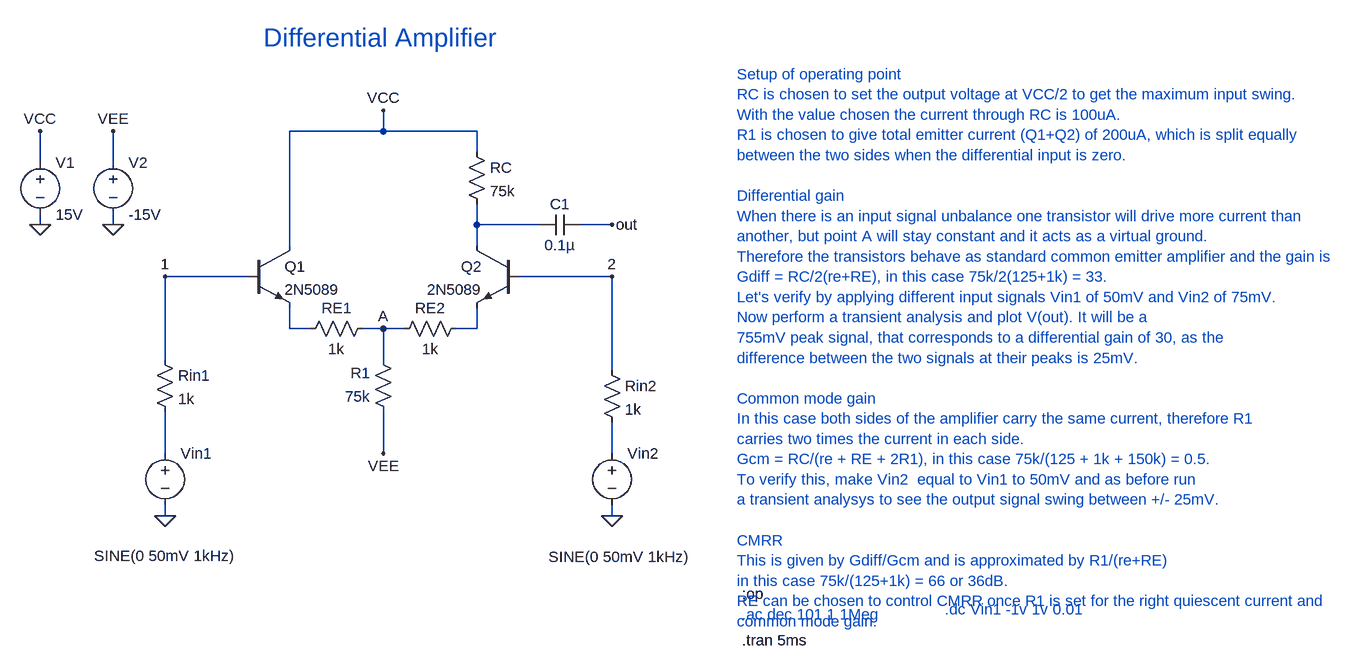
[diagram p0: schematic Figure2.68.asc]
Figure2.68.asc, the LTspice schematic file:
Version 4
SHEET 1 2392 1424
WIRE 272 -64 272 -96
WIRE 272 -64 128 -64
WIRE 416 -64 272 -64
WIRE 416 -32 416 -64
WIRE -256 -16 -256 -64
WIRE -144 -16 -144 -64
WIRE -256 80 -256 64
WIRE -144 80 -144 64
WIRE 416 80 416 48
WIRE 512 80 416 80
WIRE 624 80 576 80
WIRE 128 112 128 -64
WIRE 416 112 416 80
WIRE 64 160 -64 160
WIRE 624 160 480 160
WIRE 128 240 128 208
WIRE 160 240 128 240
WIRE 272 240 240 240
WIRE 304 240 272 240
WIRE 416 240 416 208
WIRE 416 240 384 240
WIRE -64 288 -64 160
WIRE 272 288 272 240
WIRE 624 304 624 160
WIRE -64 432 -64 368
WIRE 272 432 272 368
WIRE 624 432 624 384
WIRE -64 528 -64 512
WIRE 624 528 624 512
FLAG -256 80 0
FLAG -144 80 0
FLAG -256 -64 VCC
FLAG -144 -64 VEE
FLAG 272 432 VEE
FLAG 272 -96 VCC
FLAG -64 528 0
FLAG 624 80 out
FLAG 272 240 A
FLAG 624 160 2
FLAG 624 528 0
FLAG -64 160 1
SYMBOL npn 64 112 R0
SYMATTR InstName Q1
SYMATTR Value 2N5089
SYMBOL npn 480 112 M0
SYMATTR InstName Q2
SYMATTR Value 2N5089
SYMBOL res 256 224 R90
WINDOW 0 0 56 VBottom 2
WINDOW 3 32 56 VTop 2
SYMATTR InstName RE1
SYMATTR Value 1k
SYMBOL res 400 224 R90
WINDOW 0 0 56 VBottom 2
WINDOW 3 32 56 VTop 2
SYMATTR InstName RE2
SYMATTR Value 1k
SYMBOL res 288 384 R180
WINDOW 0 36 76 Left 2
WINDOW 3 36 40 Left 2
SYMATTR InstName R1
SYMATTR Value 75k
SYMBOL voltage -256 -32 R0
WINDOW 123 0 0 Left 0
WINDOW 39 0 0 Left 0
SYMATTR InstName V1
SYMATTR Value 15V
SYMBOL voltage -144 -32 R0
WINDOW 123 0 0 Left 0
WINDOW 39 0 0 Left 0
SYMATTR InstName V2
SYMATTR Value -15V
SYMBOL voltage -64 416 R0
WINDOW 3 -109 174 Left 2
WINDOW 123 -48 148 Left 2
WINDOW 39 0 0 Left 0
SYMATTR Value SINE(0 50mV 1kHz)
SYMATTR InstName Vin1
SYMBOL res 400 -48 R0
SYMATTR InstName RC
SYMATTR Value 75k
SYMBOL cap 576 64 R90
WINDOW 0 0 32 VBottom 2
WINDOW 3 32 32 VTop 2
SYMATTR InstName C1
SYMATTR Value 0.1µ
SYMBOL voltage 624 416 R0
WINDOW 3 -98 175 Left 2
WINDOW 123 -98 203 Left 2
WINDOW 39 0 0 Left 0
SYMATTR Value SINE(0 50mV 1kHz)
SYMATTR InstName Vin2
SYMBOL res -80 272 R0
SYMATTR InstName Rin1
SYMATTR Value 1k
SYMBOL res 608 288 R0
SYMATTR InstName Rin2
SYMATTR Value 1k
TEXT 824 648 Left 2 !;op
TEXT 816 -152 Left 2 ;Setup of operating point\nRC is chosen to set the output voltage at VCC/2 to get the maximum input swing.\nWith the value chosen the current through RC is 100uA.\nR1 is chosen to give total emitter current (Q1+Q2) of 200uA, which is split equally\nbetween the two sides when the differential input is zero.\n \nDifferential gain\nWhen there is an input signal unbalance one transistor will drive more current than \nanother, but point A will stay constant and it acts as a virtual ground.\nTherefore the transistors behave as standard common emitter amplifier and the gain is\nGdiff = RC/2(re+RE), in this case 75k/2(125+1k) = 33.\nLet's verify by applying different input signals Vin1 of 50mV and Vin2 of 75mV.\nNow perform a transient analysis and plot V(out). It will be a \n755mV peak signal, that corresponds to a differential gain of 30, as the \ndifference between the two signals at their peaks is 25mV.\n \nCommon mode gain\nIn this case both sides of the amplifier carry the same current, therefore R1\ncarries two times the current in each side.\nGcm = RC/(re + RE + 2R1), in this case 75k/(125 + 1k + 150k) = 0.5.\nTo verify this, make Vin2  equal to Vin1 to 50mV and as before run \na transient analysys to see the output signal swing between +/- 25mV.\n \nCMRR\nThis is given by Gdiff/Gcm and is approximated by R1/(re+RE) \nin this case 75k/(125+1k) = 66 or 36dB.\nRE can be chosen to control CMRR once R1 is set for the right quiescent current and \ncommon mode gain.
TEXT 824 680 Left 2 ;.ac dec 101 1 1Meg
TEXT 88 -208 Left 4 ;Differential Amplifier
TEXT 824 720 Left 2 !.tran 5ms
TEXT 1136 672 Left 2 ;.dc Vin1 -1v 1v 0.01

The netlist it stands for:
* Figure2.68.asc
Q1 VCC 1 N002 0 2N5089
Q2 N001 2 N003 0 2N5089
RE1 A N002 1k
RE2 N003 A 1k
R1 VEE A 75k
V1 VCC 0 15V
V2 VEE 0 -15V
Vin1 N004 0 SINE(0 50mV 1kHz)
RC VCC N001 75k
C1 out N001 0.1µ
Vin2 N005 0 SINE(0 50mV 1kHz)
Rin1 1 N004 1k
Rin2 2 N005 1k
.model NPN NPN
.model PNP PNP
.lib standard.bjt
;op
* Setup of operating point
* RC is chosen to set the output voltage at VCC/2 to get the maximum input swing.
* With the value chosen the current through RC is 100uA.
* R1 is chosen to give total emitter current (Q1+Q2) of 200uA, which is split equally
* between the two sides when the differential input is zero.
* Differential gain
* When there is an input signal unbalance one transistor will drive more current than
* another, but point A will stay constant and it acts as a virtual ground.
* Therefore the transistors behave as standard common emitter amplifier and the gain is
* Gdiff = RC/2(re+RE), in this case 75k/2(125+1k) = 33.
* Let's verify by applying different input signals Vin1 of 50mV and Vin2 of 75mV.
* Now perform a transient analysis and plot V(out). It will be a
* 755mV peak signal, that corresponds to a differential gain of 30, as the
* difference between the two signals at their peaks is 25mV.
* Common mode gain
* In this case both sides of the amplifier carry the same current, therefore R1
* carries two times the current in each side.
* Gcm = RC/(re + RE + 2R1), in this case 75k/(125 + 1k + 150k) = 0.5.
* To verify this, make Vin2  equal to Vin1 to 50mV and as before run
* a transient analysys to see the output signal swing between +/- 25mV.
* CMRR
* This is given by Gdiff/Gcm and is approximated by R1/(re+RE)
* in this case 75k/(125+1k) = 66 or 36dB.
* RE can be chosen to control CMRR once R1 is set for the right quiescent current and
* common mode gain.
* .ac dec 101 1 1Meg
* Differential Amplifier
.tran 5ms
* .dc Vin1 -1v 1v 0.01
.backanno
.end